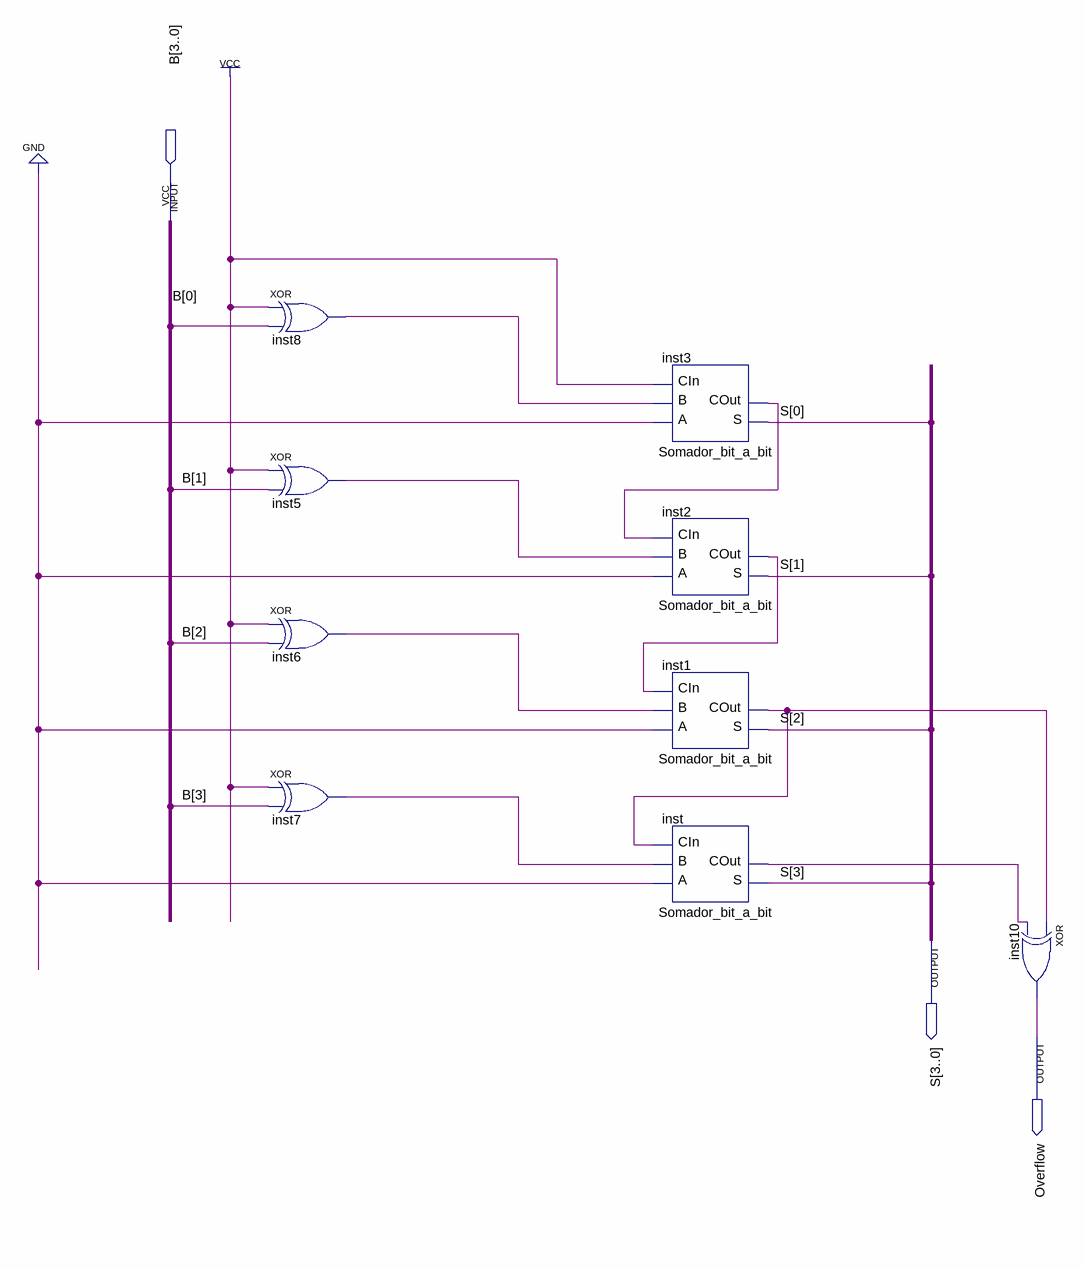
[diagram p0: schematic sheet]
// Quartus schematic Complementador_completo.bdf as structural Verilog: 9 symbols, 3 pins
module Complementador_completo (
  input  [3:0] B,
  output [3:0] S,
  output Overflow
);

  wire inst1_cout, inst2_cout, inst3_cout, inst5_out, inst6_out, inst7_out, inst8_out, inst_cout;

  xor inst8 (inst8_out, 1'b1, B[0]);
  xor inst5 (inst5_out, 1'b1, B[1]);
  xor inst6 (inst6_out, 1'b1, B[2]);
  xor inst7 (inst7_out, 1'b1, B[3]);
  Somador_bit_a_bit inst3 (.A(1'b0), .B(inst8_out), .CIn(1'b1), .S(S[0]), .COut(inst3_cout));
  Somador_bit_a_bit inst2 (.A(1'b0), .B(inst5_out), .CIn(inst3_cout), .S(S[1]), .COut(inst2_cout));
  Somador_bit_a_bit inst1 (.A(1'b0), .B(inst6_out), .CIn(inst2_cout), .S(S[2]), .COut(inst1_cout));
  Somador_bit_a_bit inst (.A(1'b0), .B(inst7_out), .CIn(inst1_cout), .S(S[3]), .COut(inst_cout));
  xor inst10 (Overflow, inst1_cout, inst_cout);
endmodule
